# EAGLE design avga (EAGLE 4.11)
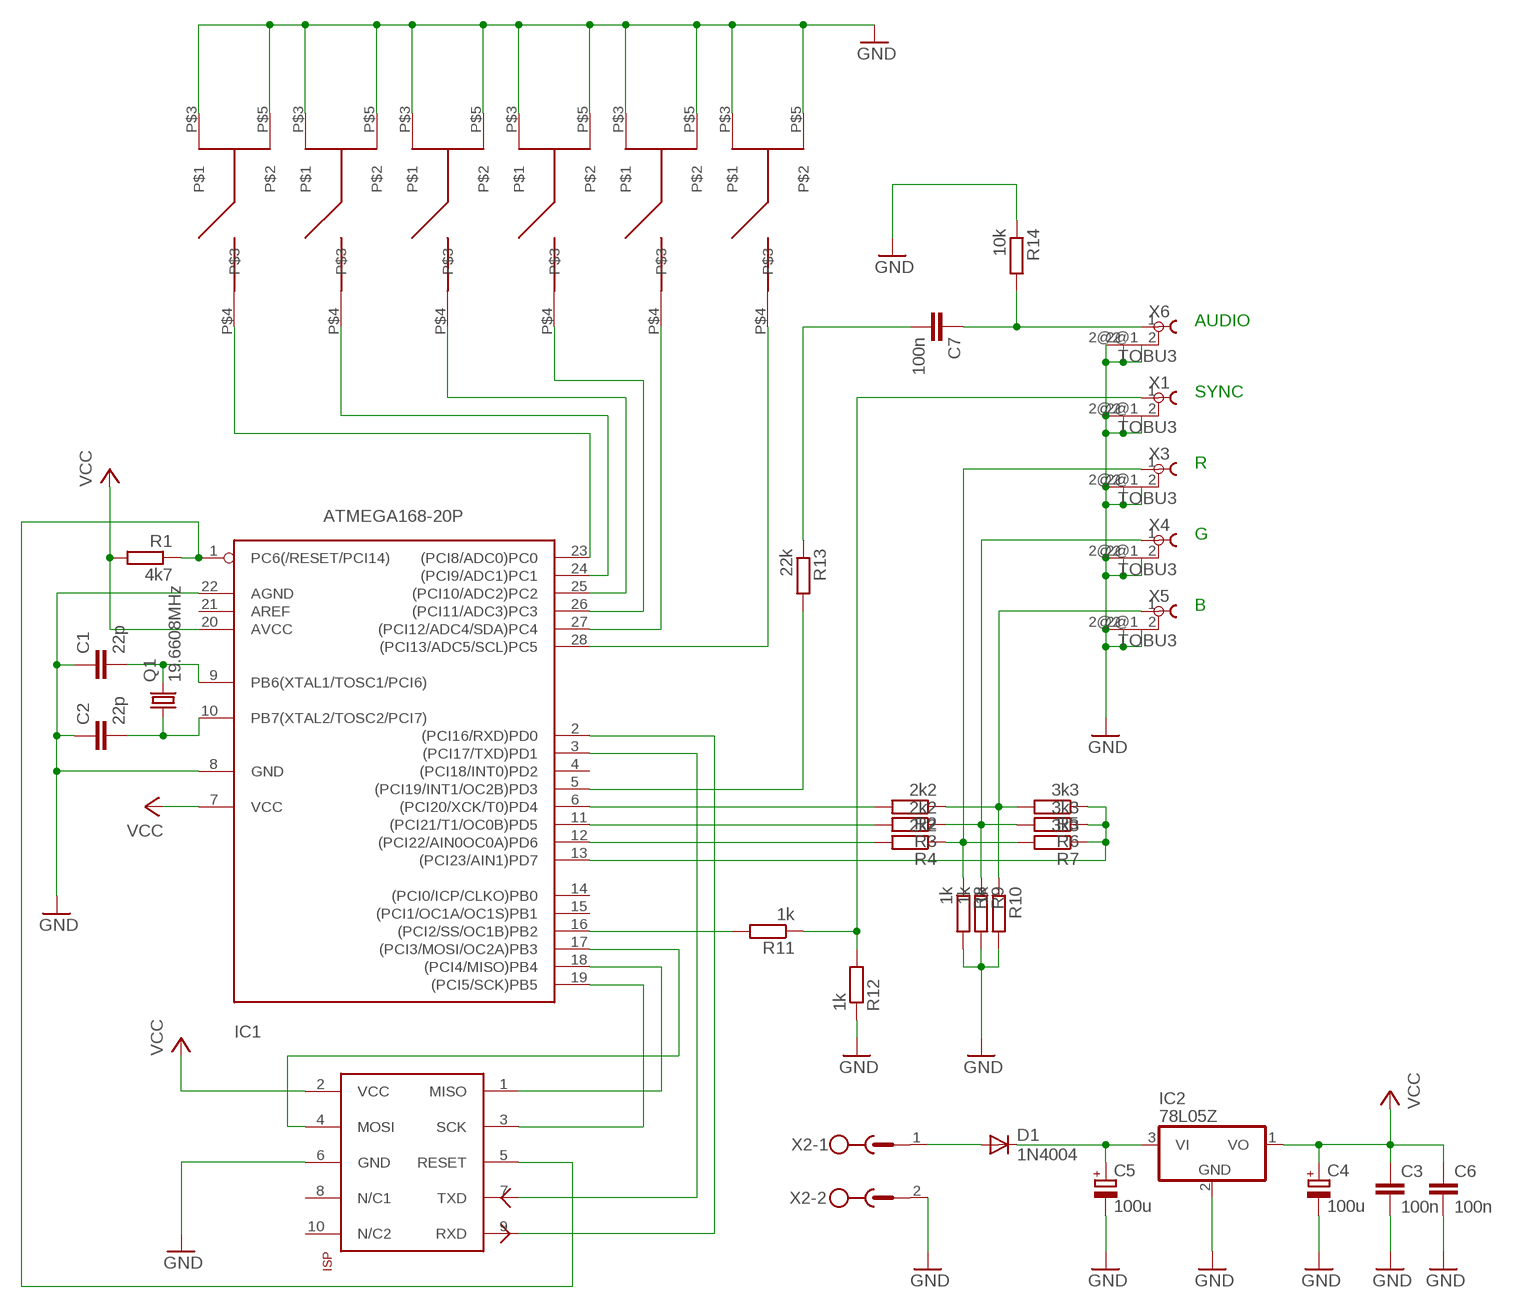
[diagram p0: schematic, sheet 1]

## Parts
C1  22p  C-EU050-025X075  [C050-025X075]
C2  22p  C-EU050-025X075  [C050-025X075]
C3  100n  C-EU050-025X075  [C050-025X075]
C4  100u  CPOL-EUE5-8.5  [E5-8,5]
C5  100u  CPOL-EUE5-8.5  [E5-8,5]
C6  100n  C-EU050-025X075  [C050-025X075]
C7  100n  C-EU050-025X075  [C050-025X075]
D1  1N4004  [DO41-10]
IC1  ATMEGA168-20P  [DIL28-3]
IC2  78L05Z  [TO92]
Q1  19.6608MHz  CRYTALHC49U-V  [HC49U-V]
R1  4k7  R-EU_0204/7  [0204/7]
R2  2k2  R-EU_0204/7  [0204/7]
R3  2k2  R-EU_0204/7  [0204/7]
R4  2k2  R-EU_0204/7  [0204/7]
R5  3k3  R-EU_0204/7  [0204/7]
R6  3k3  R-EU_0204/7  [0204/7]
R7  3k3  R-EU_0204/7  [0204/7]
R8  1k  R-EU_0204/7  [0204/7]
R9  1k  R-EU_0204/7  [0204/7]
R10  1k  R-EU_0204/7  [0204/7]
R11  1k  R-EU_0204/7  [0204/7]
R12  1k  R-EU_0204/7  [0204/7]
R13  22k  R-EU_0204/7  [0204/7]
R14  10k  R-EU_0204/7  [0204/7]
U$1  KEYBUTTON  [KEYBUTTON]
U$2  KEYBUTTON  [KEYBUTTON]
U$3  KEYBUTTON  [KEYBUTTON]
U$4  KEYBUTTON  [KEYBUTTON]
U$5  KEYBUTTON  [KEYBUTTON]
U$6  KEYBUTTON  [KEYBUTTON]
U$7  CON-ISP  [CON-ISP]
X1  TOBU3  [TOBU3]
X2  MSTBV2  [MSTBV2]
X3  TOBU3  [TOBU3]
X4  TOBU3  [TOBU3]
X5  TOBU3  [TOBU3]
X6  TOBU3  [TOBU3]

## Nets
B: R2.1 R5.2 R10.1 X5.1
G: R3.1 R6.2 R9.1 X4.1
GND: C1.1 C2.1 C3.2 C4.- C5.- C6.2 IC1.8(GND) IC1.22(AGND) IC2.2(GND) R8.2 R9.2 R10.2 R12.1 R14.1 U$1.P$3 U$1.P$5 U$2.P$3 U$2.P$5 U$3.P$3 U$3.P$5 U$4.P$3 U$4.P$5 U$5.P$3 U$5.P$5 U$6.P$3 U$6.P$5 U$7.6(GND) X1.2 X1.2@1 X1.2@2 X2.2 X3.2 X3.2@1 X3.2@2 X4.2 X4.2@1 X4.2@2 X5.2 X5.2@1 X5.2@2 X6.2 X6.2@1 X6.2@2
N$1: C1.2 IC1.9(PB6(XTAL1/TOSC1/PCI6)) Q1.2
N$2: IC1.1(PC6(/RESET/PCI14)) R1.1 U$7.5(RESET)
N$3: C2.2 IC1.10(PB7(XTAL2/TOSC2/PCI7)) Q1.1
N$4: IC1.11((PCI21/T1/OC0B)PD5) R3.2
N$5: IC1.6((PCI20/XCK/T0)PD4) R2.2
N$6: IC1.12((PCI22/AIN0OC0A)PD6) R4.2
N$7: IC1.13((PCI23/AIN1)PD7) R5.1 R6.1 R7.1
N$8: D1.A X2.1
N$9: IC1.23((PCI8/ADC0)PC0) U$6.P$4
N$10: IC1.24((PCI9/ADC1)PC1) U$5.P$4
N$11: IC1.25((PCI10/ADC2)PC2) U$4.P$4
N$12: C5.+ D1.C IC2.3(VI)
N$13: IC1.26((PCI11/ADC3)PC3) U$3.P$4
N$14: IC1.16((PCI2/SS/OC1B)PB2) R11.2
N$15: IC1.27((PCI12/ADC4/SDA)PC4) U$2.P$4
N$16: IC1.28((PCI13/ADC5/SCL)PC5) U$1.P$4
N$17: IC1.5((PCI19/INT1/OC2B)PD3) R13.2
N$18: C7.2 R13.1
N$19: C7.1 R14.2 X6.1
N$29: IC1.18((PCI4/MISO)PB4) U$7.1(MISO)
N$30: IC1.17((PCI3/MOSI/OC2A)PB3) U$7.4(MOSI)
N$31: IC1.19((PCI5/SCK)PB5) U$7.3(SCK)
N$32: IC1.2((PCI16/RXD)PD0) U$7.9(RXD)
N$33: IC1.3((PCI17/TXD)PD1) U$7.7(TXD)
R: R4.1 R7.2 R8.1 X3.1
SYNC: R11.1 R12.2 X1.1
VCC: C3.1 C4.+ C6.1 IC1.7(VCC) IC1.20(AVCC) IC2.1(VO) R1.2 U$7.2(VCC)
Unconnected: IC1.4((PCI18/INT0)PD2) IC1.14((PCI0/ICP/CLKO)PB0) IC1.15((PCI1/OC1A/OC1S)PB1) IC1.21(AREF) U$7.8(N/C1) U$7.10(N/C2)

## Notes on the sheet
- AUDIO
- SYNC
- R
- G
- B

## Library data of the parts
C1-C3 C6 C7 = rcl:C-EU: CAPACITOR, European symbol
C4 C5 = rcl:CPOL-EU: POLARIZED CAPACITOR, European symbol
D1 = diode:1N4004: DIODE general purpose rectifier, 1 A
IC1 = avr:ATMEGA168*P: MICROCONTROLLER 16 kBytes FLASH 1 kBytes SRAM 512 Bytes EEPROM USART 8-channel 10 bit ADC
IC2 = linear:78*: Positive VOLTAGE REGULATOR
Q1 = crystal:CRYTAL: CRYSTAL
R1-R14 = rcl:R-EU_: RESISTOR, European symbol
U$1-U$6 = keybutton:KEYBUTTON
U$7 = con-isp:CON-ISP
X1 X3-X6 = con-hirschmann:TOBU3: Female Cinch CONNECTOR
X2 = con-phoenix-500:MSTBV2: PHOENIX

## Board
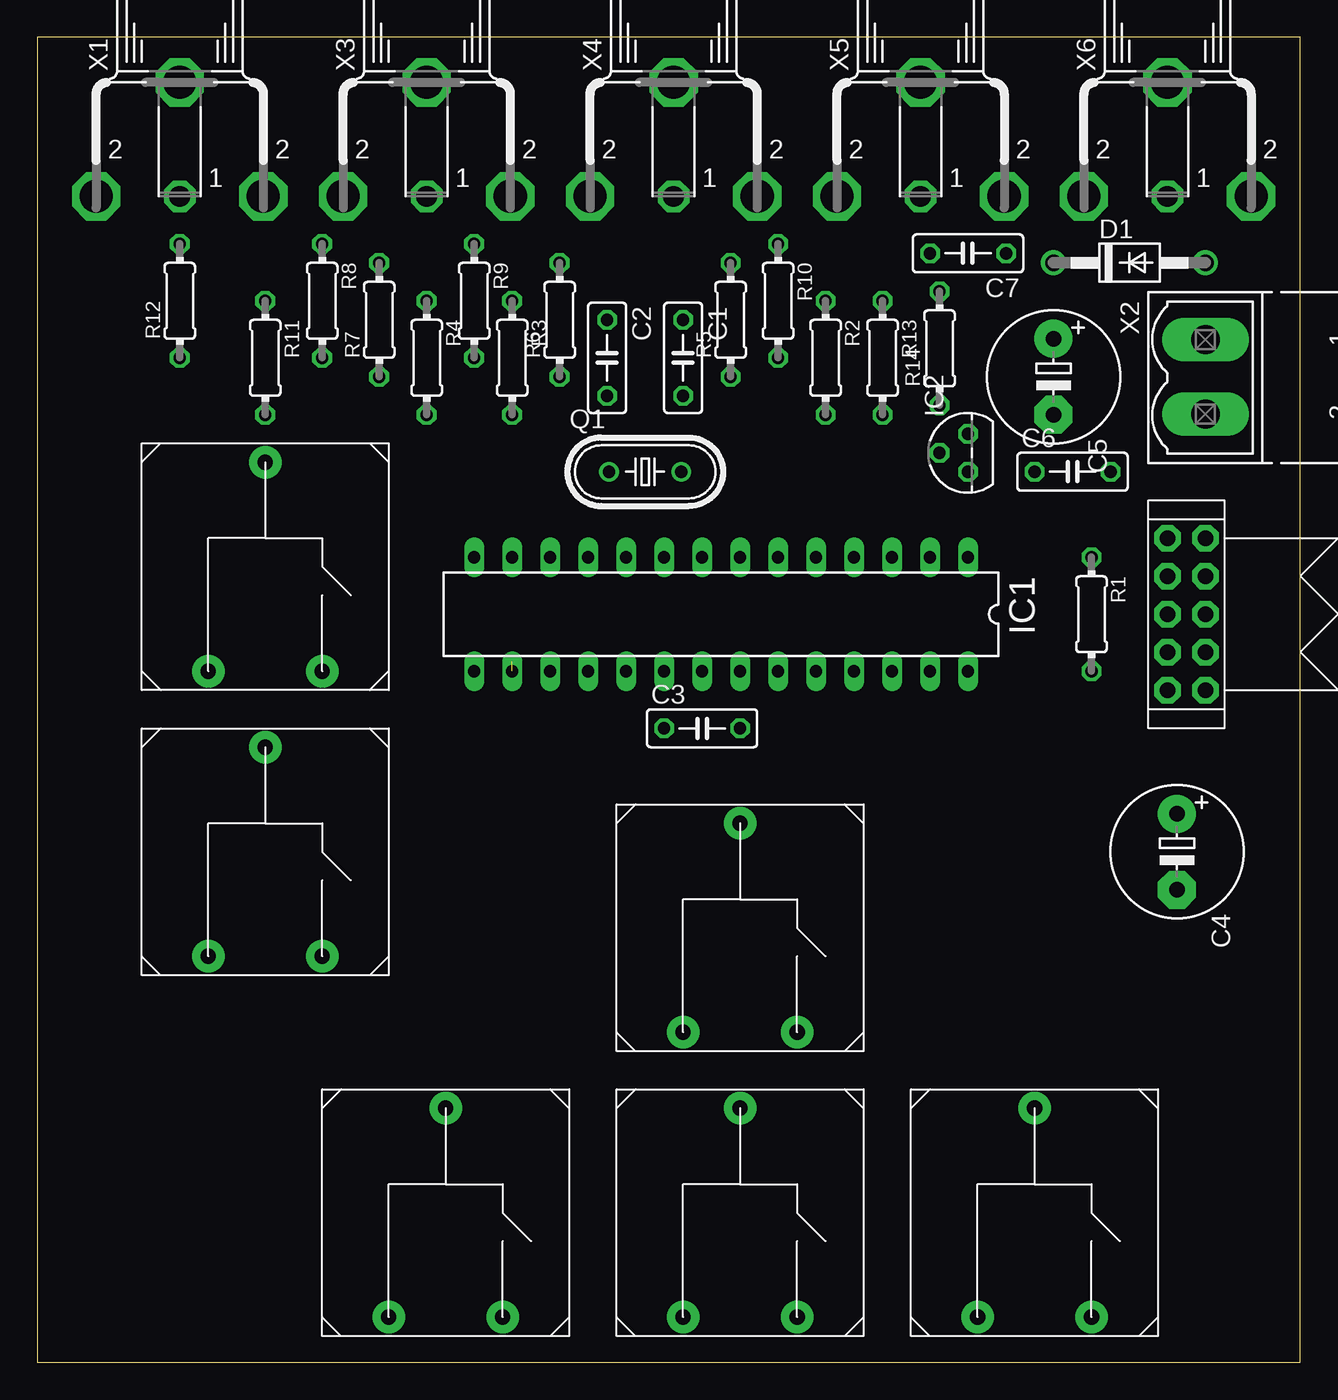
[diagram p1: board, top side]
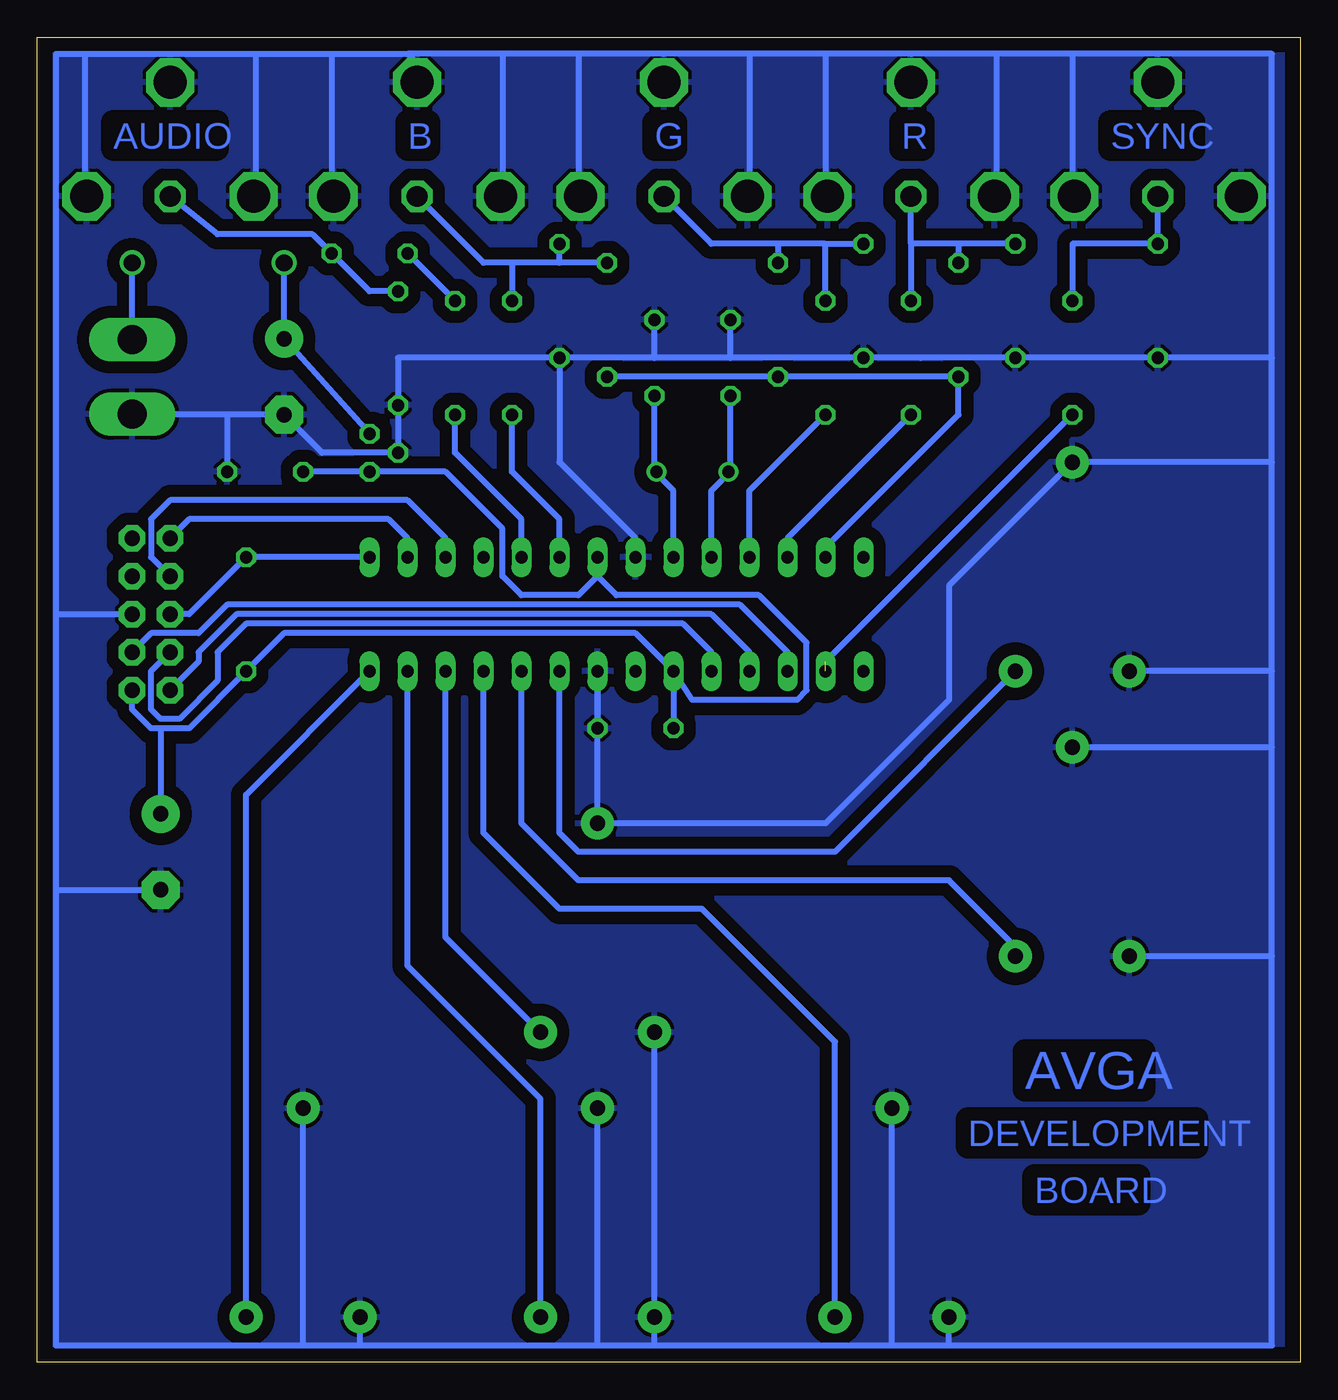
[diagram p2: board, bottom side, seen from below]

Size 84.44 x 88.57 mm. Coordinates in mm from the lower left corner, seen from the top.
Outline: 0,0 84.44,0 84.44,88.57 0,88.57 0,0
Copper layers (1*16): Top 0.035mm / dielectric 1.5mm / Bottom 0.035mm
Design rules "default": minimum track width 10mil, minimum drill 24mil, track to track 8mil, track to pad 8mil, pad to pad 8mil, via to via 8mil, smd to smd 8mil, copper to edge 40mil, drill to drill 8mil, minimum pad ring 10mil, minimum via ring 8mil, stop-mask expansion 4mil, vias tented up to drill 0mil, thermal gap 10mil

### Footprints (pad centres in the part's own frame; a part is rotated, then mirrored left to right if it is on the bottom)
C050-025X075 = drill 0.813 octagon: 1 -2.54,0; 2 2.54,0
E5-8,5 = drill 1.016 pad 2.54 round: + -2.54,0 | drill 1.016 pad 2.54 octagon: - 2.54,0
DO41-10 = drill 1.118 round: A 5.08,0; C -5.08,0
DIL28-3 = drill 0.813 long: 1 -16.51,-3.81; 2 -13.97,-3.81; 3 -11.43,-3.81; 4 -8.89,-3.81; 5 -6.35,-3.81; 6 -3.81,-3.81; 7 -1.27,-3.81; 8 1.27,-3.81; 9 3.81,-3.81; 10 6.35,-3.81; 11 8.89,-3.81; 12 11.43,-3.81; 13 13.97,-3.81; 14 16.51,-3.81; 15 16.51,3.81; 16 13.97,3.81; 17 11.43,3.81; 18 8.89,3.81; 19 6.35,3.81; 20 3.81,3.81; 21 1.27,3.81; 22 -1.27,3.81; 23 -3.81,3.81; 24 -6.35,3.81; 25 -8.89,3.81; 26 -11.43,3.81; 27 -13.97,3.81; 28 -16.51,3.81
TO92 = drill 0.813 octagon: 1 -1.27,0; 2 0,1.905; 3 1.27,0
HC49U-V = drill 0.813 round: 1 -2.413,0; 2 2.413,0
0204/7 = drill 0.813 octagon: 1 -3.81,0; 2 3.81,0
KEYBUTTON = drill 1.016 pad 2.184 round: P$3 -3.81,-6.35; P$4 3.81,-6.35; P$5 0,7.62
CON-ISP = drill 1.016 pad 1.778 octagon: 1 -5.08,1.27; 2 -5.08,-1.27; 3 -2.54,1.27; 4 -2.54,-1.27; 5 0,1.27; 6 0,-1.27; 7 2.54,1.27; 8 2.54,-1.27; 9 5.08,1.27; 10 5.08,-1.27
TOBU3 = drill 1.397 octagon: 1 0,-2.54 | drill 2.21 octagon: 2 5.588,-2.54; 2@1 -5.588,-2.54; 2@2 0,5.08
MSTBV2 = drill 1.93 pad 2.184 long: 1 -2.5,0; 2 2.5,0

### Placement (x,y rotation side)
C1  43.17,67.14 270 top
C2  38.09,67.14 270 top
C3  44.45,42.38 0 top
C4  76.2,34.12 270 top
C5  67.94,65.88 270 top
C6  69.21,59.52 0 top
C7  62.23,74.13 180 top
D1  73.02,73.5 0 top
IC1  45.72,50 180 top
IC2  62.23,60.8 90 top
Q1  40.63,59.52 0 top
R1  70.48,50 270 top
R2  52.7,67.14 270 top
R3  31.75,67.14 270 top
R4  26.03,67.14 270 top
R5  46.35,69.69 90 top
R6  34.92,69.69 90 top
R7  22.86,69.69 90 top
R8  19.05,70.95 270 top
R9  29.21,70.95 270 top
R10  49.52,70.95 270 top
R11  15.24,67.14 270 top
R12  9.52,70.95 90 top
R13  56.51,67.14 270 top
R14  60.32,67.78 90 top
U$1  66.67,9.36 0 top
U$2  46.98,9.36 0 top
U$3  46.98,28.41 0 top
U$4  27.3,9.36 0 top
U$5  15.24,33.49 0 top
U$6  15.24,52.54 0 top
U$7  76.83,50 90 top
X1  9.52,80.48 0 top
X2  78.1,65.88 270 top
X3  26.03,80.48 0 top
X4  42.54,80.48 0 top
X5  59.05,80.48 0 top
X6  75.56,80.48 0 top

### Tracks (layer width: path | path; a pad name or v marks a point on that pad's centre or on a via)
B
  Bottom 0.406: 52.7,73.5 R2.1 | X5.1 54.61,73.5 52.7,73.5 | R5.2 49.52,73.5 | 49.52,73.5 52.7,73.5 | 49.52,73.5 R10.1
G
  Bottom 0.406: R3.1 31.75,74.77 | 31.75,74.77 R9.1 | 31.75,74.77 34.92,74.77 | 34.92,74.77 R6.2 | X4.1 39.37,74.77 34.92,74.77
GND
  Bottom 0.406: IC1.8 44.45,55.08 49.52,60.16 R10.2 | 38.09,67.14 43.17,67.14 | 38.09,67.14 R9.2 R8.2 | 38.09,67.14 C2.1 | 43.17,67.14 C1.1 | R8.2 25.39,67.14 | X2.2 76.83,63.34 71.75,63.34 | 71.75,63.34 C5.- 65.4,60.8 IC2.2 | R14.1 60.32,67.14 R10.2 | R14.1 IC2.2 | 71.75,63.34 C6.2 | IC1.22 C3.2 | IC1.22 C3.2 | 1.9,27.14 1.9,1.1 23.49,1.1 | 1.9,27.14 1.9,41.11 | 1.9,41.11 1.9,46.19 | 1.9,46.19 1.9,60.16 | 1.9,60.16 1.9,67.14 | 46.98,1.1 62.86,1.1 | 62.86,1.1 66.67,1.1 | 66.67,1.1 83.18,1.1 83.18,31.58 | 43.17,1.1 46.98,1.1 | 83.18,31.58 83.18,50 | 83.18,50 83.18,77.94 83.18,87.47 81.28,87.47 | 15.24,87.47 9.52,87.47 1.9,87.47 1.9,67.14 | 15.24,87.47 20.32,87.47 | 20.32,87.47 26.03,87.47 31.75,87.47 | 31.75,87.47 36.83,87.47 | 36.83,87.47 42.54,87.47 48.26,87.47 | 48.26,87.47 53.34,87.47 | 53.34,87.47 59.69,87.47 | 81.28,87.47 75.56,87.47 69.84,87.47 | 64.77,87.47 59.69,87.47 | 69.84,87.47 64.77,87.47 | R8.2 R12.1 1.9,67.14 | 1.9,46.19 U$6.P$3 | 1.9,27.14 U$5.P$3 | 1.9,41.11 U$5.P$5 | C3.2 46.98,41.74 | 1.9,60.16 U$6.P$5 23.49,51.91 23.49,44.28 31.75,36.03 U$3.P$5 IC1.22 | 27.3,1.1 U$4.P$5 | 27.3,1.1 43.17,1.1 | 23.49,1.1 27.3,1.1 | 23.49,1.1 U$4.P$3 | 43.17,1.1 U$2.P$3 U$3.P$3 | 46.98,1.1 U$2.P$5 | 62.86,1.1 U$1.P$3 | 66.67,1.1 U$1.P$5 | 83.18,31.58 C4.- | 83.18,50 U$7.6 | 59.69,87.47 59.05,86.83 | 43.17,67.14 R10.2 | R14.1 IC2.2 | 15.24,87.47 15.24,77.94 | 20.32,87.47 20.32,77.94 | 31.75,87.47 31.75,77.94 | 36.83,87.47 36.83,77.94 | 48.26,87.47 48.26,77.94 | 53.34,87.47 53.34,77.94 | 64.77,87.47 64.77,77.94 | 69.84,87.47 69.84,77.94 | 81.28,87.47 81.28,77.94 | X4.2@2 41.91,85.56 | X1.2@2 10.16,85.56
  pour Bottom (isolate 0.813): -1.28,93.81 97.78,93.81 97.78,-12.23 -6.99,-12.23 -6.99,93.81
N$1
  Bottom 0.406: 43.17,59.52 Q1.2 | 43.17,59.52 C1.2 | IC1.9 41.91,58.25 43.17,59.52
N$2
  Bottom 0.406: U$7.5 74.29,50 R1.1 IC1.1
N$3
  Bottom 0.406: 38.09,59.52 Q1.1 | 38.09,59.52 C2.2 | IC1.10 39.37,58.25 38.09,59.52
N$4
  Bottom 0.406: IC1.11 36.83,58.25 R3.2
N$5
  Bottom 0.406: R2.2 52.7,59.52 49.52,56.35 IC1.6
N$6
  Bottom 0.406: IC1.12 34.29,55.08 R4.2
N$7
  Bottom 0.406: R5.1 R6.1 R7.1 22.86,63.34 31.75,54.45 IC1.13
N$8
  Bottom 0.406: X2.1 D1.A
N$9
  Bottom 0.406: U$6.P$4 31.11,34.12 48.26,34.12 49.52,35.39 IC1.23
N$10
  Bottom 0.406: IC1.24 52.06,36.03 48.26,32.22 23.49,32.22 19.05,27.77 U$5.P$4
N$11
  Bottom 0.406: IC1.25 54.61,35.39 49.52,30.31 40,30.31 31.11,21.42 U$4.P$4
N$12
  Bottom 0.406: D1.C C5.+ IC2.3
N$13
  Bottom 0.406: IC1.26 57.15,28.41 U$3.P$4
N$14  (1 unrouted)
  Bottom 0.406: 31.75,45.55 31.75,46.82 R11.2
N$15
  Bottom 0.406: IC1.27 59.69,26.5 50.8,17.61 U$2.P$4
N$16
  Bottom 0.406: U$1.P$4 70.48,37.94 IC1.28
N$17
  Bottom 0.406: R13.2 56.51,60.8 52.06,56.35 IC1.5
N$18
  Bottom 0.406: R13.1 C7.2
N$19
  Bottom 0.406: R14.2 62.23,71.59 C7.1 66.03,75.4 72.39,75.4 X6.1
N$29
  Bottom 0.406: IC1.18 36.83,47.46 39.37,50 71.11,50 73.66,47.46 73.66,46.82 U$7.1
N$30
  Bottom 0.406: IC1.17 34.29,47.46 37.46,50.63 71.75,50.63 73.66,48.73 76.83,48.73 U$7.4
N$31
  Bottom 0.406: IC1.19 39.37,47.46 41.27,49.37 70.48,49.37 72.39,47.46 72.39,45.55 74.92,43.02 76.2,43.02 76.83,43.65 76.83,46.19 U$7.3
N$32
  Bottom 0.406: IC1.2 59.69,55.08 60.95,56.35 74.29,56.35 U$7.9
N$33
  Bottom 0.406: U$7.7 76.83,53.81 76.83,56.35 75.56,57.62 59.69,57.62 57.15,55.08 IC1.3
R
  Bottom 0.406: R8.1 22.86,74.77 | 22.86,74.77 26.03,74.77 | 22.86,74.77 R7.2 | 26.03,74.77 R4.1 | 26.03,74.77 X3.1
SYNC
  Bottom 0.406: X1.1 R12.2 15.24,74.77 R11.1
VCC
  Bottom 0.406: U$7.2 78.1,43.65 76.83,42.38 76.2,42.38 | 76.2,42.38 74.29,42.38 R1.2 67.94,48.73 44.45,48.73 IC1.20 | IC1.20 C3.1 | 46.98,52.54 IC1.7 | 46.98,52.54 45.72,51.27 36.19,51.27 33.02,48.09 33.02,44.92 33.65,44.28 40.63,44.28 IC1.20 | 46.98,52.54 48.26,51.27 52.06,51.27 53.34,52.54 53.34,55.71 57.15,59.52 IC2.1 C6.1 | 76.2,42.38 C4.+

### Text on the board
Bottom: SYNC | R | G | B | AUDIO | AVGA | DEVELOPMENT | BOARD